# EAGLE design fabflash-mk-2.3-battcon-flattened (EAGLE 6.5.0)
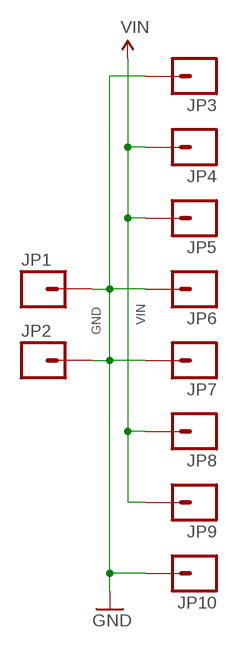
[diagram p0: schematic, sheet 1]

## Parts
JP1  M01NOT-A-VIA-NOPE  [1X01_NOSILK_NOSTOP]
JP2  M01NOT-A-VIA-NOPE  [1X01_NOSILK_NOSTOP]
JP3  M01SMD-1X2.5MM-NS  [1X01-SMD-1X2.5MM-NS]
JP4  M01NOSILK-KIT  [1X01NS-KIT]
JP5  M01NOSILK-KIT  [1X01NS-KIT]
JP6  M01SMD-1X2.5MM-NS  [1X01-SMD-1X2.5MM-NS]
JP7  M01SMD-1X2.5MM-NS  [1X01-SMD-1X2.5MM-NS]
JP8  M01NOSILK-KIT  [1X01NS-KIT]
JP9  M01NOSILK-KIT  [1X01NS-KIT]
JP10  M01SMD-1X2.5MM-NS  [1X01-SMD-1X2.5MM-NS]

## Nets
GND: JP1.P$1 JP2.P$1 JP3.1 JP6.1 JP7.1 JP10.1
VIN: JP4.1 JP5.1 JP8.1 JP9.1

## Library data of the parts
JP1-JP10 = A_butts:M01: Header 1 Standard 1-pin 0.1" header. Use with straight break away headers (SKU : PRT-00116), right angle break away headers (PRT-00553), swiss pins (PRT-00743), machine pins (PRT-00117), and female headers (PRT-00115).

## Board
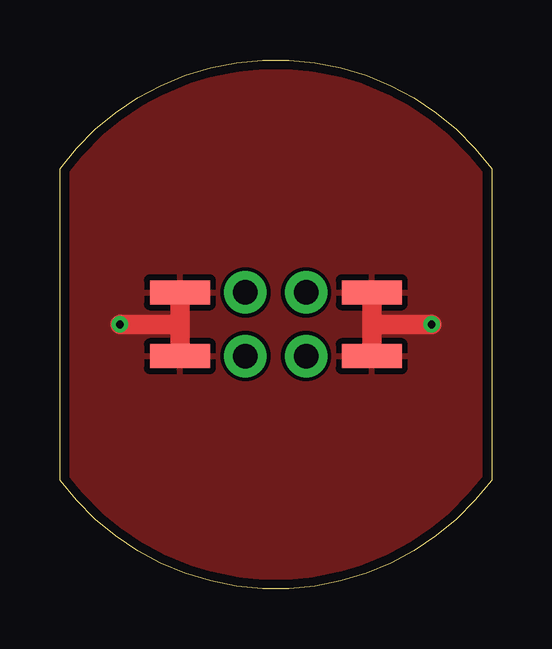
[diagram p1: board, top side]
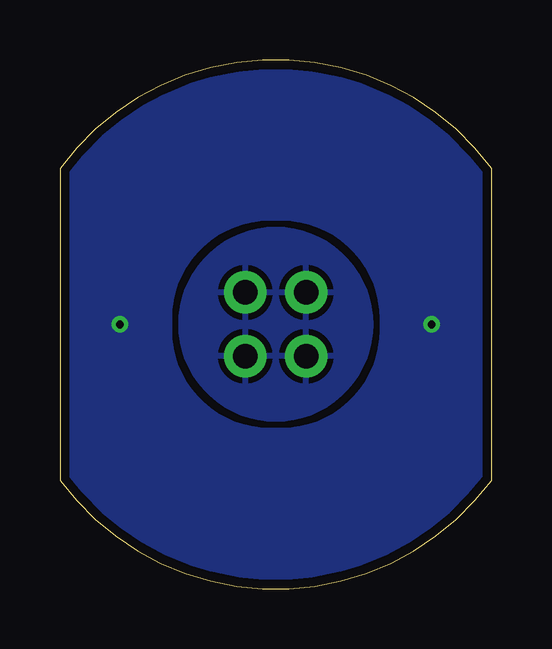
[diagram p2: board, bottom side, seen from below]

Size 18 x 22.05 mm. Coordinates in mm from the lower left corner, seen from the top.
Outline: 0,4.52 0,17.52 arc-107 18,17.52 18,4.52 arc-107 0,4.52
Copper layers (1*16): Top 0.0356mm / dielectric 1.5011mm / Bottom 0.0356mm
Design rules "LaenPCBOrder2": minimum track width 6mil, minimum drill 13mil, track to track 6mil, track to pad 6mil, pad to pad 6mil, via to via 6mil, smd to smd 6mil, copper to edge 15mil, drill to drill 6mil, minimum pad ring 7mil, minimum via ring 7mil, stop-mask expansion 3mil, vias tented up to drill 20mil, thermal gap 10mil

### Footprints (pad centres in the part's own frame; a part is rotated, then mirrored left to right if it is on the bottom)
1X01_NOSILK_NOSTOP = drill 0.33: P$1 0,0
1X01-SMD-1X2.5MM-NS = smd 1 x 2.5: 1 0,0
1X01NS-KIT = drill 1.016 pad 1.778: 1 0,0

### Placement (x,y rotation side)
JP1  2.5,11.02 0 top
JP2  15.5,11.02 0 top
JP3  5,12.35 270 top
JP4  10.27,12.35 90 top
JP5  7.73,12.35 90 top
JP6  13,12.35 90 top
JP7  5,9.69 270 top
JP8  7.73,9.69 270 top
JP9  10.27,9.69 270 top
JP10  13,9.69 90 top

### Tracks (layer width: path | path; a pad name or v marks a point on that pad's centre or on a via)
GND
  Top 0.813: JP7.1 5,11.02 | 5,11.02 JP3.1 | JP10.1 13,11.02 | 13,11.02 JP6.1 | JP2.P$1 13,11.02 | JP1.P$1 5,11.02
  pour Top: 0,22.02 18,22.02 18,0.02 0,0.02
  pour Bottom (isolate 0.254, rank 6): 0,22.02 18,22.02 18,0.02 0,0.02
VIN
  pour Bottom: 9,7.02 arc-90 5,11.02 arc-90 9,15.02 arc-90 13,11.02 arc-90